# Altium project bms_mainboard-1_1.PrjPcb (part 1 of 8)
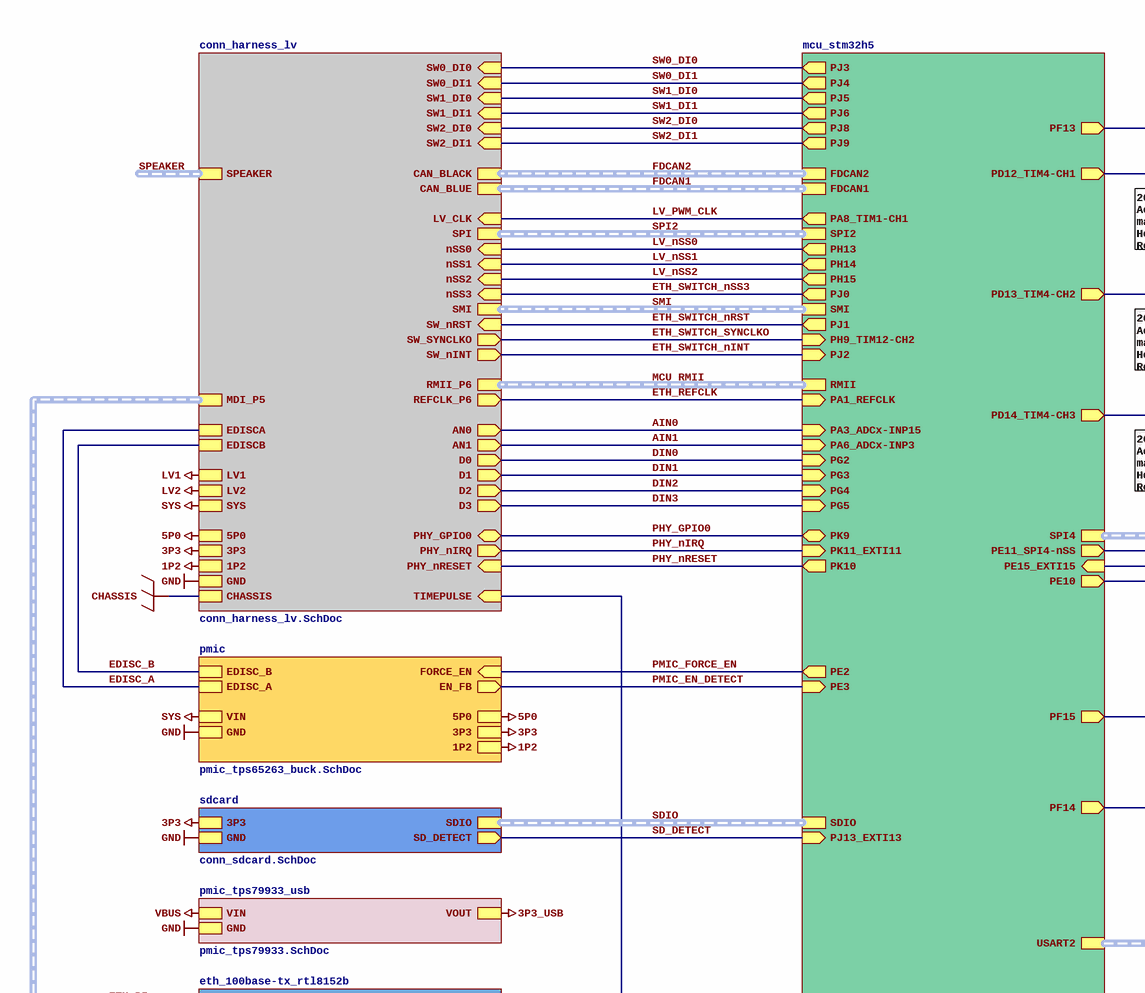
[diagram p0: top.SchDoc, top left]
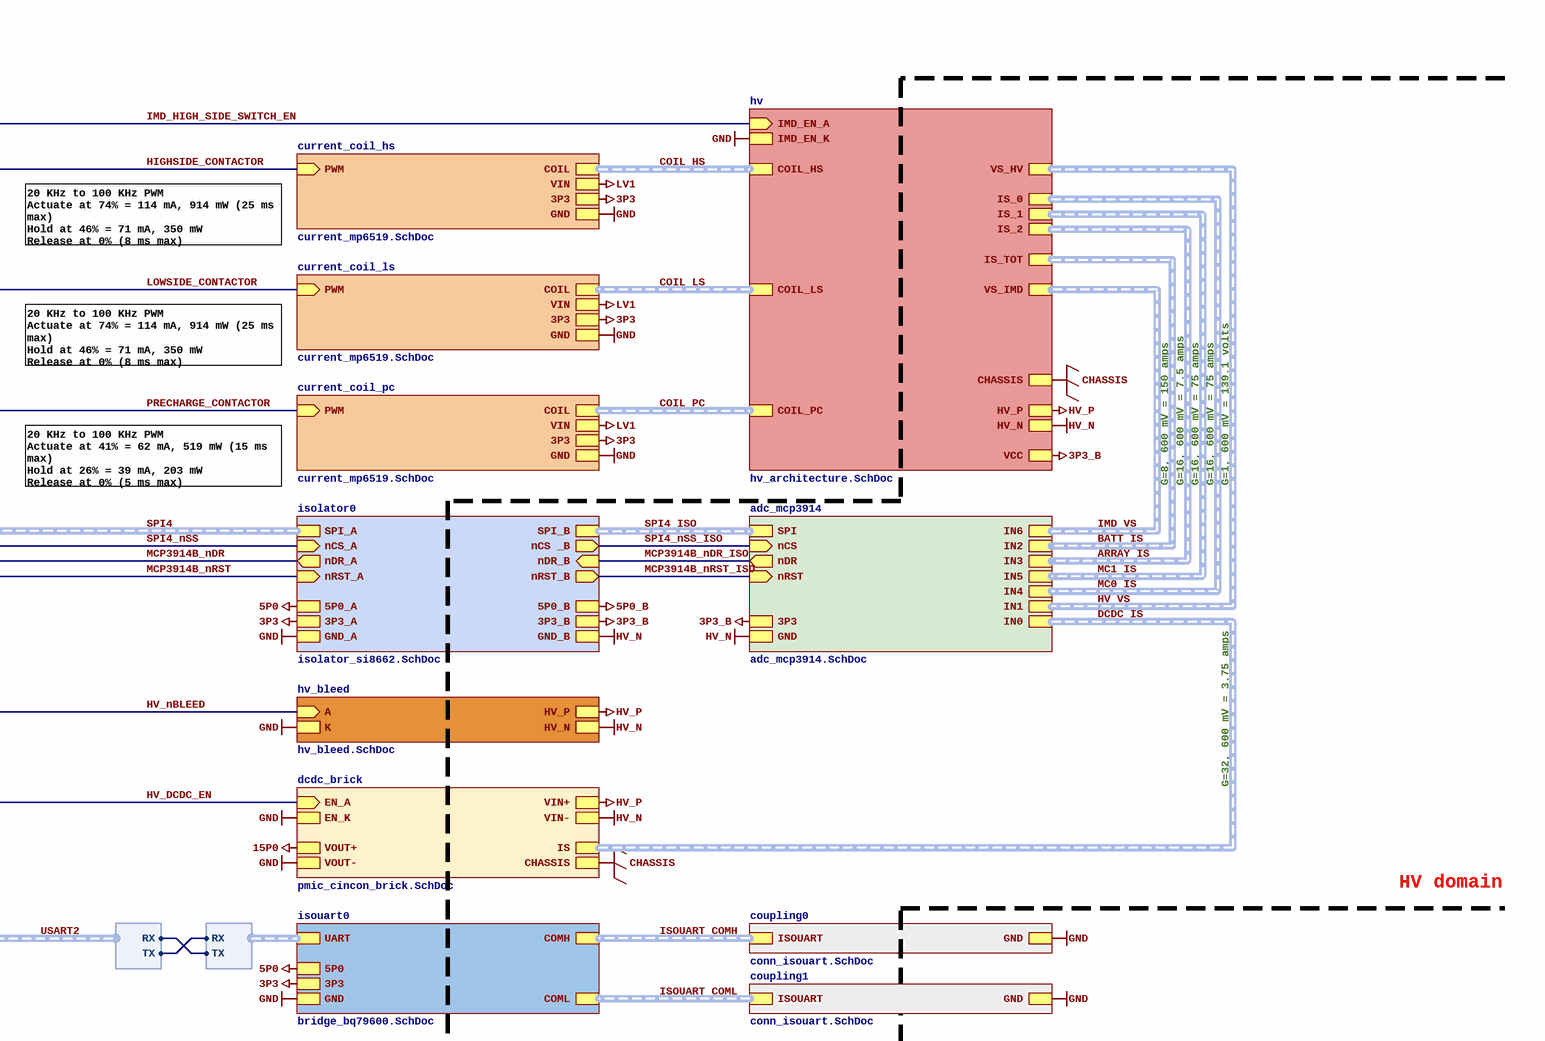
[diagram p1: top.SchDoc, top right]
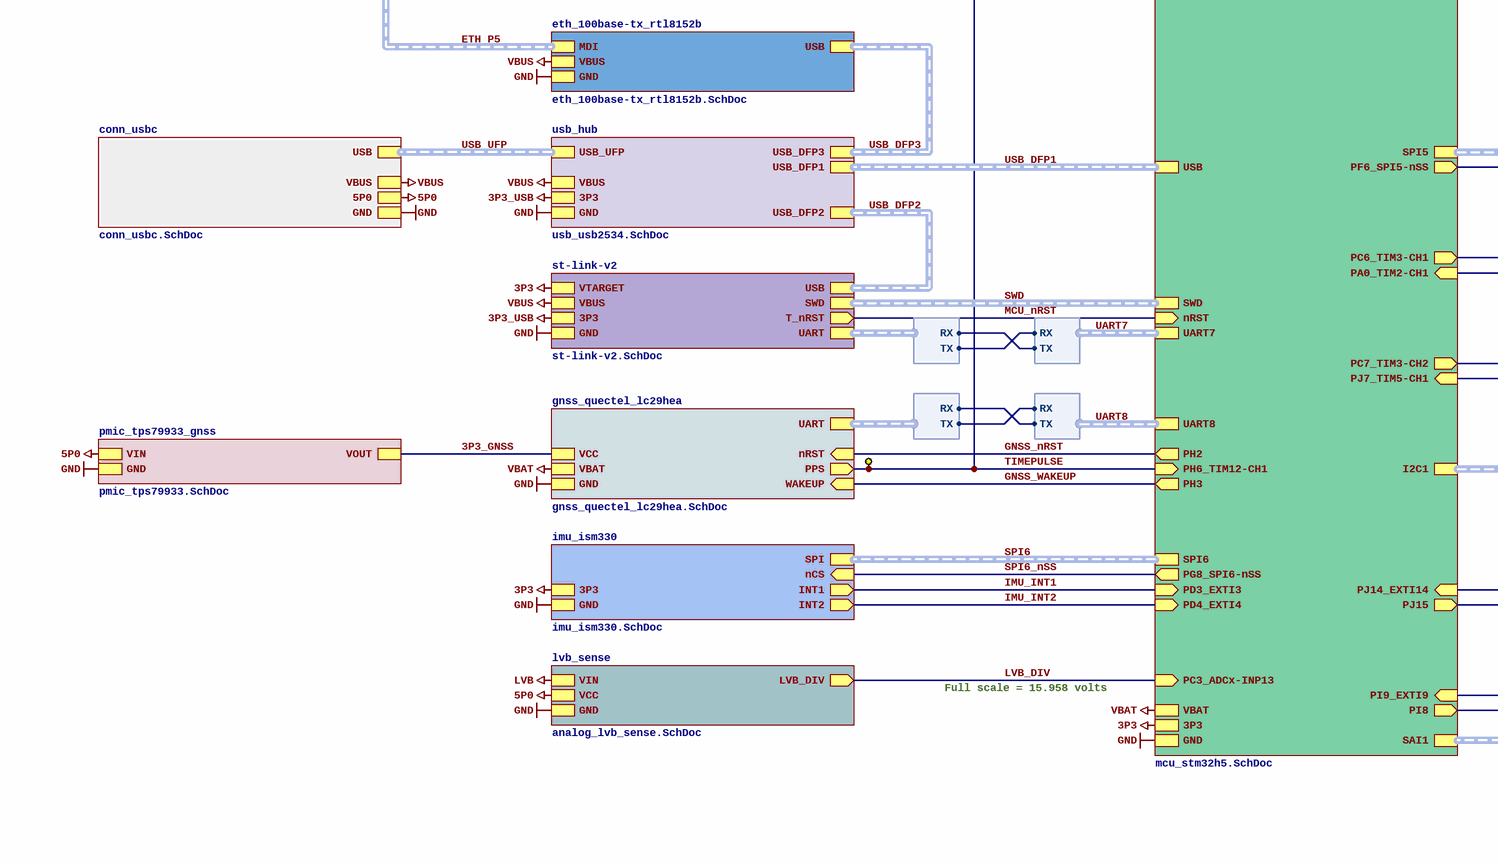
[diagram p2: top.SchDoc, bottom left]
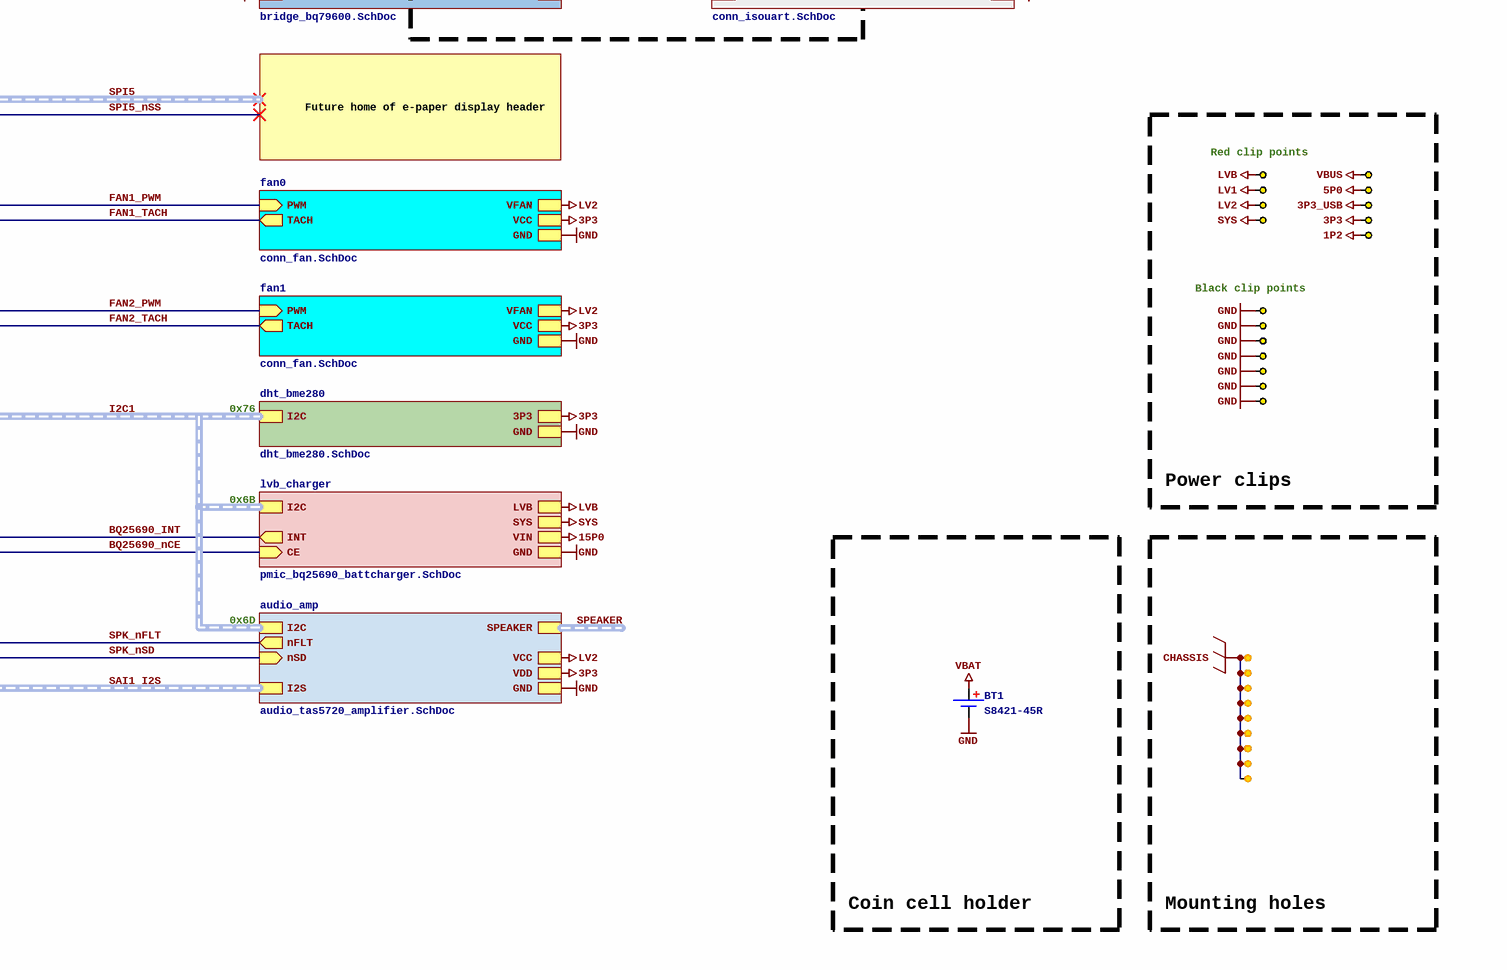
[diagram p3: top.SchDoc, bottom right]
35 sheets, 964 parts. Net scope: strictly hierarchical (ports join the sheet entries above them; power ports are local).
Board file: bms_mainboard-1_1.PcbDoc
Sheets:
  top.SchDoc
    coupling0 = conn_isouart.SchDoc
    isouart0 = bridge_bq79600.SchDoc
    mcu_stm32h5 = mcu_stm32h5.SchDoc
      ref_mcp1502_2p5 = ref_mcp1502_2p5.SchDoc
    pmic = pmic_tps65263_buck.SchDoc
    sdcard = conn_sdcard.SchDoc
    adc_mcp3914 = adc_mcp3914.SchDoc
      shunt0 = filter_diff_shunt.SchDoc
      shunt2 = filter_diff_shunt.SchDoc
      shunt3 = filter_diff_shunt.SchDoc
      shunt4 = filter_diff_shunt.SchDoc
      shunt5 = filter_diff_shunt.SchDoc
    hv = hv_architecture.SchDoc
      hv_buffer0 = analog_tlv379_buffer.SchDoc
      hv_buffer1 = analog_tlv379_buffer.SchDoc
    fan0 = conn_fan.SchDoc
    hv_bleed = hv_bleed.SchDoc
    current_coil_hs = current_mp6519.SchDoc
    current_coil_ls = current_mp6519.SchDoc
    current_coil_pc = current_mp6519.SchDoc
    dcdc_brick = pmic_cincon_brick.SchDoc
    usb_hub = usb_usb2534.SchDoc
    conn_usbc = conn_usbc.SchDoc
    st-link-v2 = st-link-v2.SchDoc
    conn_harness_lv = conn_harness_lv.SchDoc
      can1 = can_tcan1462v.SchDoc
      can0 = can_tcan1462v.SchDoc
      ethernet_switch = eth_ksz8567r_switch.SchDoc
        mag0 = eth_100base-tx_magnetics.SchDoc
        mag1 = eth_100base-tx_magnetics.SchDoc
        mag2 = eth_100base-tx_magnetics.SchDoc
      lv_switch0 = switch_vn9e30f.SchDoc
      lv_switch1 = switch_vn9e30f.SchDoc
      lv_switch2 = switch_vn9e30f.SchDoc
      sensor0 = analog_sensor_input.SchDoc
      sensor1 = analog_sensor_input.SchDoc
      digital0 = digital_input_protection.SchDoc
      digital1 = digital_input_protection.SchDoc
      digital2 = digital_input_protection.SchDoc
      digital3 = digital_input_protection.SchDoc
      eth_10base-t1s_phy = eth_10base-t1s_phy.SchDoc
    isolator0 = isolator_si8662.SchDoc
    pmic_tps79933_usb = pmic_tps79933.SchDoc
    imu_ism330 = imu_ism330.SchDoc
    dht_bme280 = dht_bme280.SchDoc
    gnss_quectel_lc29hea = gnss_quectel_lc29hea.SchDoc
    pmic_tps79933_gnss = pmic_tps79933.SchDoc
    lvb_sense = analog_lvb_sense.SchDoc
    coupling1 = conn_isouart.SchDoc
    fan1 = conn_fan.SchDoc
    lvb_charger = pmic_bq25690_battcharger.SchDoc
    audio_amp = audio_tas5720_amplifier.SchDoc
    eth_100base-tx_rtl8152b = eth_100base-tx_rtl8152b.SchDoc

## Sheet top.SchDoc
size C; SheetNumber: 1

### Parts
BT1  S8421-45R  [HOLDER_BATT_CR2032_HARWIN_S8421-45R]
MH1  HOLE  [HOLE_M3]  (value not drawn)  (no BOM)
MH2  HOLE  [HOLE_M3]  (value not drawn)  (no BOM)
MH3  HOLE  [HOLE_M3]  (value not drawn)  (no BOM)
MH4  HOLE  [HOLE_M3]  (value not drawn)  (no BOM)
MH5  HOLE  [HOLE_M3]  (value not drawn)  (no BOM)
MH6  HOLE  [HOLE_M3]  (value not drawn)  (no BOM)
MH7  HOLE  [HOLE_M3]  (value not drawn)  (no BOM)
MH8  HOLE  [HOLE_M3]  (value not drawn)  (no BOM)
MH9  HOLE  [HOLE_M3]  (value not drawn)  (no BOM)
TP4  RH-5002  [TP_RH-5002]  (value not drawn)
TP5  RH-5000  [TP_RH-5000]  (value not drawn)
TP32  RH-5000  [TP_RH-5000]  (value not drawn)
TP33  RH-5000  [TP_RH-5000]  (value not drawn)
TP34  RH-5000  [TP_RH-5000]  (value not drawn)
TP35  RH-5000  [TP_RH-5000]  (value not drawn)
TP36  RH-5000  [TP_RH-5000]  (value not drawn)
TP37  RH-5000  [TP_RH-5000]  (value not drawn)
TP39  RH-5001  [TP_RH-5001]  (value not drawn)
TP41  RH-5001  [TP_RH-5001]  (value not drawn)
TP43  RH-5001  [TP_RH-5001]  (value not drawn)
TP45  RH-5001  [TP_RH-5001]  (value not drawn)
TP46  RH-5001  [TP_RH-5001]  (value not drawn)
TP47  RH-5001  [TP_RH-5001]  (value not drawn)
TP48  RH-5001  [TP_RH-5001]  (value not drawn)
TP89  RH-5000  [TP_RH-5000]  (value not drawn)
TP90  RH-5000  [TP_RH-5000]  (value not drawn)

### Blocks framed on the sheet
Power clips: TP5 TP32-TP37 TP39 TP41 TP43 TP45-TP48 TP89 TP90
Coin cell holder: BT1
Mounting holes: MH1-MH9

### Sub-sheets
adc_mcp3914 = adc_mcp3914.SchDoc: IN0 (harness DIFF), IN1 (harness DIFF), IN2 (harness DIFF), IN3 (harness DIFF), IN4 (harness DIFF), IN5 (harness DIFF), SPI (harness SPI), 3P3, GND, nCS (in), nDR (out), nRST (in), IN6 (harness DIFF)
audio_amp = audio_tas5720_amplifier.SchDoc: GND, VCC, VDD, SPEAKER (harness DIFF), I2C (harness I2C), nFLT (out), nSD (in), I2S (harness I2S)
conn_harness_lv = conn_harness_lv.SchDoc: GND, 3P3, 5P0, SPI (harness SPI), AN0 (out), AN1 (out), nSS2 (in), nSS1 (in), nSS0 (in), SW_nRST (in), REFCLK_P6 (out), LV_CLK (in), EDISCA, EDISCB, D0 (out), D1 (out), D2 (out), D3 (out), CAN_BLUE (harness CAN), CAN_BLACK (harness CAN), SMI (harness SMI), RMII_P6 (harness RMII), LV2, LV1, 1P2, TIMEPULSE (in), SYS, CHASSIS, nSS3 (in), PHY_GPIO0 (bidir), PHY_nIRQ (out), PHY_nRESET (in), SW_SYNCLKO (out), SW_nINT (out), SPEAKER (harness DIFF), MDI_P5 (harness 100BASE-TX), SW0_DI0 (in), SW0_DI1 (in), SW2_DI0 (in), SW2_DI1 (in), SW1_DI0 (in), SW1_DI1 (in)
conn_usbc = conn_usbc.SchDoc: 5P0, USB (harness DIFF), GND, VBUS
coupling0 = conn_isouart.SchDoc: ISOUART (harness DIFF), GND
coupling1 = conn_isouart.SchDoc: ISOUART (harness DIFF), GND
current_coil_hs = current_mp6519.SchDoc: COIL (harness DIFF), VIN, PWM (in), GND, 3P3
current_coil_ls = current_mp6519.SchDoc: COIL (harness DIFF), VIN, PWM (in), GND, 3P3
current_coil_pc = current_mp6519.SchDoc: COIL (harness DIFF), VIN, PWM (in), GND, 3P3
dcdc_brick = pmic_cincon_brick.SchDoc: EN_A (in), EN_K, VIN+, VIN-, VOUT+, VOUT-, IS (harness DIFF), CHASSIS
dht_bme280 = dht_bme280.SchDoc: I2C (harness I2C), GND, 3P3
eth_100base-tx_rtl8152b = eth_100base-tx_rtl8152b.SchDoc: VBUS, GND, USB (harness DIFF), MDI (harness 100BASE-TX)
fan0 = conn_fan.SchDoc: GND, VFAN, PWM (in), VCC, TACH (out)
fan1 = conn_fan.SchDoc: GND, VFAN, PWM (in), VCC, TACH (out)
gnss_quectel_lc29hea = gnss_quectel_lc29hea.SchDoc: GND, VCC, VBAT, PPS (out), nRST (in), UART (harness UART), WAKEUP (in)
hv = hv_architecture.SchDoc: IS_0 (harness DIFF), IS_1 (harness DIFF), IS_2 (harness DIFF), IS_TOT (harness DIFF), COIL_HS (harness DIFF), COIL_LS (harness DIFF), COIL_PC (harness DIFF), HV_P, HV_N, VS_HV (harness DIFF), CHASSIS, VS_IMD (harness DIFF), IMD_EN_A (in), IMD_EN_K, VCC
hv_bleed = hv_bleed.SchDoc: A (in), K, HV_N, HV_P
imu_ism330 = imu_ism330.SchDoc: 3P3, GND, INT1 (out), INT2 (out), SPI (harness SPI), nCS (in)
isolator0 = isolator_si8662.SchDoc: SPI_A (harness SPI), nCS_A (in), nRST_A (in), nDR_A (out), SPI_B (harness SPI), nCS _B (out), nRST_B (out), nDR_B (in), 3P3_A, GND_A, 5P0_A, 3P3_B, GND_B, 5P0_B
isouart0 = bridge_bq79600.SchDoc: COMH (harness DIFF), GND, 3P3, UART (harness UART), 5P0, COML (harness DIFF)
lvb_charger = pmic_bq25690_battcharger.SchDoc: I2C (harness I2C), LVB, SYS, VIN, GND, INT (out), CE (in)
lvb_sense = analog_lvb_sense.SchDoc: LVB_DIV (out), VIN, VCC, GND
mcu_stm32h5 = mcu_stm32h5.SchDoc: GND, 3P3, SDIO (harness SDIO), VBAT, SPI4 (harness SPI), PA1_REFCLK (in), RMII (harness RMII), SMI (harness SMI), PD12_TIM4-CH1 (out), PD13_TIM4-CH2 (out), USB (harness DIFF), SWD (harness SWD), UART7 (harness UART), nRST (in), SPI2 (harness SPI), PD14_TIM4-CH3 (out), PA3_ADCx-INP15 (in), PA6_ADCx-INP3 (in), PE11_SPI4-nSS (out), PA0_TIM2-CH1 (in), PJ7_TIM5-CH1 (in), PC6_TIM3-CH1 (out), PC7_TIM3-CH2 (out), PJ13_EXTI13 (in), PE10 (out), UART8 (harness UART), I2C1 (harness I2C), PH6_TIM12-CH1 (in), PH13 (out), PH14 (out), PJ0 (out), PH2 (out), PE15_EXTI15 (in), SPI5 (harness SPI), PF6_SPI5-nSS (out), PF15 (out), PF14 (out), PG2 (in), PG3 (in), PG5 (in), PG4 (in), PK11_EXTI11 (in), PK10 (out), PK9 (bidir), PE2 (out), PE3 (in), SPI6 (harness SPI), PG8_SPI6-nSS (out), PD3_EXTI3 (in), PD4_EXTI4 (in), PH9_TIM12-CH2 (in), PJ2 (in), PJ1 (out), USART2 (harness UART), PH3 (out), PA8_TIM1-CH1 (out), FDCAN2 (harness CAN), FDCAN1 (harness CAN), PH15 (out), PC3_ADCx-INP13 (in), PF13 (out), PJ15 (out), PJ14_EXTI14 (in), PI9_EXTI9 (in), PI8 (out), SAI1 (harness I2S), PJ3 (out), PJ4 (out), PJ5 (out), PJ6 (out), PJ8 (out), PJ9 (out)
pmic = pmic_tps65263_buck.SchDoc: VIN, 5P0, GND, 3P3, 1P2, EDISC_A, EDISC_B, FORCE_EN (in), EN_FB (out)
pmic_tps79933_gnss = pmic_tps79933.SchDoc: GND, VIN, VOUT
pmic_tps79933_usb = pmic_tps79933.SchDoc: GND, VIN, VOUT
sdcard = conn_sdcard.SchDoc: 3P3, GND, SD_DETECT (out), SDIO (harness SDIO)
st-link-v2 = st-link-v2.SchDoc: USB (harness DIFF), GND, 3P3, VBUS, SWD (harness SWD), T_nRST (out), UART (harness UART), VTARGET
usb_hub = usb_usb2534.SchDoc: 3P3, GND, USB_DFP2 (harness DIFF), USB_DFP1 (harness DIFF), USB_UFP (harness DIFF), VBUS, USB_DFP3 (harness DIFF)

### Harnesses
UART: RX, TX

### Nets
1P2: TP37.1 ; sheet pmic/1P2, sheet conn_harness_lv/1P2
3P3: TP35.1 ; sheet isouart0/3P3, sheet mcu_stm32h5/3P3, sheet pmic/3P3, sheet sdcard/3P3, sheet fan0/VCC, sheet current_coil_hs/3P3, sheet current_coil_ls/3P3, sheet current_coil_pc/3P3, sheet st-link-v2/VTARGET, sheet conn_harness_lv/3P3, sheet isolator0/3P3_A, sheet imu_ism330/3P3, sheet dht_bme280/3P3, sheet fan1/VCC, sheet audio_amp/VDD
3P3_B: sheet adc_mcp3914/3P3, sheet hv/VCC, sheet isolator0/3P3_B
3P3_USB: TP90.1 ; sheet usb_hub/3P3, sheet st-link-v2/3P3, sheet pmic_tps79933_usb/VOUT
5P0: TP33.1 ; sheet isouart0/5P0, sheet pmic/5P0, sheet conn_usbc/5P0, sheet conn_harness_lv/5P0, sheet isolator0/5P0_A, sheet pmic_tps79933_gnss/VIN, sheet lvb_sense/VCC
15P0: sheet dcdc_brick/VOUT+, sheet lvb_charger/VIN
CHASSIS: MH1.1 MH2.1 MH3.1 MH4.1 MH5.1 MH6.1 MH7.1 MH8.1 MH9.1 ; sheet hv/CHASSIS, sheet dcdc_brick/CHASSIS, sheet conn_harness_lv/CHASSIS
GND: BT1.2(-) TP39.1 TP41.1 TP43.1 TP45.1 TP46.1 TP47.1 TP48.1 ; sheet coupling0/GND, sheet isouart0/GND, sheet mcu_stm32h5/GND, sheet pmic/GND, sheet sdcard/GND, sheet hv/IMD_EN_K, sheet fan0/GND, sheet hv_bleed/K, sheet current_coil_hs/GND, sheet current_coil_ls/GND, sheet current_coil_pc/GND, sheet dcdc_brick/EN_K, sheet dcdc_brick/VOUT-, sheet usb_hub/GND, sheet conn_usbc/GND, sheet st-link-v2/GND, sheet conn_harness_lv/GND, sheet isolator0/GND_A, sheet pmic_tps79933_usb/GND, sheet imu_ism330/GND, sheet dht_bme280/GND, sheet gnss_quectel_lc29hea/GND, sheet pmic_tps79933_gnss/GND, sheet lvb_sense/GND, sheet coupling1/GND, sheet fan1/GND, sheet lvb_charger/GND, sheet audio_amp/GND, sheet eth_100base-tx_rtl8152b/GND
HV_N: sheet adc_mcp3914/GND, sheet hv/HV_N, sheet hv_bleed/HV_N, sheet dcdc_brick/VIN-, sheet isolator0/GND_B
HV_P: sheet hv/HV_P, sheet hv_bleed/HV_P, sheet dcdc_brick/VIN+
LV1: TP34.1 ; sheet current_coil_hs/VIN, sheet current_coil_ls/VIN, sheet current_coil_pc/VIN, sheet conn_harness_lv/LV1
LV2: TP36.1 ; sheet fan0/VFAN, sheet conn_harness_lv/LV2, sheet fan1/VFAN, sheet audio_amp/VCC
LVB: TP32.1 ; sheet lvb_sense/VIN, sheet lvb_charger/LVB
SYS: TP5.1 ; sheet pmic/VIN, sheet conn_harness_lv/SYS, sheet lvb_charger/SYS
VBAT: BT1.1(+) ; sheet mcu_stm32h5/VBAT, sheet gnss_quectel_lc29hea/VBAT
VBUS: TP89.1 ; sheet usb_hub/VBUS, sheet conn_usbc/VBUS, sheet st-link-v2/VBUS, sheet pmic_tps79933_usb/VIN, sheet eth_100base-tx_rtl8152b/VBUS
3P3_GNSS: sheet gnss_quectel_lc29hea/VCC, sheet pmic_tps79933_gnss/VOUT
AIN0: sheet mcu_stm32h5/PA3_ADCx-INP15, sheet conn_harness_lv/AN0
AIN1: sheet mcu_stm32h5/PA6_ADCx-INP3, sheet conn_harness_lv/AN1
BQ25690_INT: sheet mcu_stm32h5/PJ14_EXTI14, sheet lvb_charger/INT
BQ25690_nCE: sheet mcu_stm32h5/PJ15, sheet lvb_charger/CE
DIN0: sheet mcu_stm32h5/PG2, sheet conn_harness_lv/D0
DIN1: sheet mcu_stm32h5/PG3, sheet conn_harness_lv/D1
DIN2: sheet mcu_stm32h5/PG4, sheet conn_harness_lv/D2
DIN3: sheet mcu_stm32h5/PG5, sheet conn_harness_lv/D3
EDISC_A: sheet pmic/EDISC_A, sheet conn_harness_lv/EDISCA
EDISC_B: sheet pmic/EDISC_B, sheet conn_harness_lv/EDISCB
ETH_REFCLK: sheet mcu_stm32h5/PA1_REFCLK, sheet conn_harness_lv/REFCLK_P6
ETH_SWITCH_nINT: sheet mcu_stm32h5/PJ2, sheet conn_harness_lv/SW_nINT
ETH_SWITCH_nRST: sheet mcu_stm32h5/PJ1, sheet conn_harness_lv/SW_nRST
ETH_SWITCH_nSS3: sheet mcu_stm32h5/PJ0, sheet conn_harness_lv/nSS3
ETH_SWITCH_SYNCLKO: sheet mcu_stm32h5/PH9_TIM12-CH2, sheet conn_harness_lv/SW_SYNCLKO
FAN1_PWM: sheet mcu_stm32h5/PC6_TIM3-CH1, sheet fan0/PWM
FAN1_TACH: sheet mcu_stm32h5/PA0_TIM2-CH1, sheet fan0/TACH
FAN2_PWM: sheet mcu_stm32h5/PC7_TIM3-CH2, sheet fan1/PWM
FAN2_TACH: sheet mcu_stm32h5/PJ7_TIM5-CH1, sheet fan1/TACH
GNSS_nRST: sheet mcu_stm32h5/PH2, sheet gnss_quectel_lc29hea/nRST
GNSS_WAKEUP: sheet mcu_stm32h5/PH3, sheet gnss_quectel_lc29hea/WAKEUP
HIGHSIDE_CONTACTOR: sheet mcu_stm32h5/PD12_TIM4-CH1, sheet current_coil_hs/PWM
HV_DCDC_EN: sheet mcu_stm32h5/PF14, sheet dcdc_brick/EN_A
HV_nBLEED: sheet mcu_stm32h5/PF15, sheet hv_bleed/A
IMD_HIGH_SIDE_SWITCH_EN: sheet mcu_stm32h5/PF13, sheet hv/IMD_EN_A
IMU_INT1: sheet mcu_stm32h5/PD3_EXTI3, sheet imu_ism330/INT1
IMU_INT2: sheet mcu_stm32h5/PD4_EXTI4, sheet imu_ism330/INT2
LOWSIDE_CONTACTOR: sheet mcu_stm32h5/PD13_TIM4-CH2, sheet current_coil_ls/PWM
LV_nSS0: sheet mcu_stm32h5/PH13, sheet conn_harness_lv/nSS0
LV_nSS1: sheet mcu_stm32h5/PH14, sheet conn_harness_lv/nSS1
LV_nSS2: sheet mcu_stm32h5/PH15, sheet conn_harness_lv/nSS2
LV_PWM_CLK: sheet mcu_stm32h5/PA8_TIM1-CH1, sheet conn_harness_lv/LV_CLK
LVB_DIV: sheet mcu_stm32h5/PC3_ADCx-INP13, sheet lvb_sense/LVB_DIV
MCP3914B_nDR: sheet mcu_stm32h5/PE15_EXTI15, sheet isolator0/nDR_A
MCP3914B_nDR_ISO: sheet adc_mcp3914/nDR, sheet isolator0/nDR_B
MCP3914B_nRST: sheet mcu_stm32h5/PE10, sheet isolator0/nRST_A
MCP3914B_nRST_ISO: sheet adc_mcp3914/nRST, sheet isolator0/nRST_B
MCU_nRST: sheet mcu_stm32h5/nRST, sheet st-link-v2/T_nRST
PHY_GPIO0: sheet mcu_stm32h5/PK9, sheet conn_harness_lv/PHY_GPIO0
PHY_nIRQ: sheet mcu_stm32h5/PK11_EXTI11, sheet conn_harness_lv/PHY_nIRQ
PHY_nRESET: sheet mcu_stm32h5/PK10, sheet conn_harness_lv/PHY_nRESET
PMIC_EN_DETECT: sheet mcu_stm32h5/PE3, sheet pmic/EN_FB
PMIC_FORCE_EN: sheet mcu_stm32h5/PE2, sheet pmic/FORCE_EN
PRECHARGE_CONTACTOR: sheet mcu_stm32h5/PD14_TIM4-CH3, sheet current_coil_pc/PWM
SD_DETECT: sheet mcu_stm32h5/PJ13_EXTI13, sheet sdcard/SD_DETECT
SPI4_nSS: sheet mcu_stm32h5/PE11_SPI4-nSS, sheet isolator0/nCS_A
SPI4_nSS_ISO: sheet adc_mcp3914/nCS, sheet isolator0/nCS _B
SPI6_nSS: sheet mcu_stm32h5/PG8_SPI6-nSS, sheet imu_ism330/nCS
SPK_nFLT: sheet mcu_stm32h5/PI9_EXTI9, sheet audio_amp/nFLT
SPK_nSD: sheet mcu_stm32h5/PI8, sheet audio_amp/nSD
SW0_DI0: sheet mcu_stm32h5/PJ3, sheet conn_harness_lv/SW0_DI0
SW0_DI1: sheet mcu_stm32h5/PJ4, sheet conn_harness_lv/SW0_DI1
SW1_DI0: sheet mcu_stm32h5/PJ5, sheet conn_harness_lv/SW1_DI0
SW1_DI1: sheet mcu_stm32h5/PJ6, sheet conn_harness_lv/SW1_DI1
SW2_DI0: sheet mcu_stm32h5/PJ8, sheet conn_harness_lv/SW2_DI0
SW2_DI1: sheet mcu_stm32h5/PJ9, sheet conn_harness_lv/SW2_DI1
TIMEPULSE: TP4.1 ; sheet mcu_stm32h5/PH6_TIM12-CH1, sheet conn_harness_lv/TIMEPULSE, sheet gnss_quectel_lc29hea/PPS
UART7.RX: sheet st-link-v2/UART.TX, sheet mcu_stm32h5/UART7.RX
UART7.TX: sheet st-link-v2/UART.RX, sheet mcu_stm32h5/UART7.TX
UART8.RX: sheet gnss_quectel_lc29hea/UART.TX, sheet mcu_stm32h5/UART8.RX
UART8.TX: sheet gnss_quectel_lc29hea/UART.RX, sheet mcu_stm32h5/UART8.TX
USART2.RX: sheet mcu_stm32h5/USART2.RX, sheet isouart0/UART.TX
USART2.TX: sheet mcu_stm32h5/USART2.TX, sheet isouart0/UART.RX

### Buses and harness runs
harness ARRAY_IS = sheet adc_mcp3914/IN3 = sheet hv/IS_2
harness BATT_IS = sheet adc_mcp3914/IN2 = sheet hv/IS_TOT
harness COIL_HS = sheet current_coil_hs/COIL = sheet hv/COIL_HS
harness COIL_LS = sheet current_coil_ls/COIL = sheet hv/COIL_LS
harness COIL_PC = sheet current_coil_pc/COIL = sheet hv/COIL_PC
harness DCDC_IS = sheet adc_mcp3914/IN0 = sheet dcdc_brick/IS
harness ETH_P5 = sheet conn_harness_lv/MDI_P5 = sheet eth_100base-tx_rtl8152b/MDI
harness FDCAN1 = sheet conn_harness_lv/CAN_BLUE = sheet mcu_stm32h5/FDCAN1
harness FDCAN2 = sheet conn_harness_lv/CAN_BLACK = sheet mcu_stm32h5/FDCAN2
harness HV_VS = sheet adc_mcp3914/IN1 = sheet hv/VS_HV
harness I2C1 = sheet audio_amp/I2C = sheet dht_bme280/I2C = sheet lvb_charger/I2C = sheet mcu_stm32h5/I2C1
harness IMD_VS = sheet adc_mcp3914/IN6 = sheet hv/VS_IMD
harness ISOUART_COMH = sheet coupling0/ISOUART = sheet isouart0/COMH
harness ISOUART_COML = sheet coupling1/ISOUART = sheet isouart0/COML
harness MC0_IS = sheet adc_mcp3914/IN4 = sheet hv/IS_0
harness MC1_IS = sheet adc_mcp3914/IN5 = sheet hv/IS_1
harness MCU_RMII = sheet conn_harness_lv/RMII_P6 = sheet mcu_stm32h5/RMII
harness SAI1_I2S = sheet audio_amp/I2S = sheet mcu_stm32h5/SAI1
harness SDIO = sheet mcu_stm32h5/SDIO = sheet sdcard/SDIO
harness SMI = sheet conn_harness_lv/SMI = sheet mcu_stm32h5/SMI
harness SPEAKER = sheet audio_amp/SPEAKER
harness SPEAKER = sheet conn_harness_lv/SPEAKER
harness SPI2 = sheet conn_harness_lv/SPI = sheet mcu_stm32h5/SPI2
harness SPI4 = sheet isolator0/SPI_A = sheet mcu_stm32h5/SPI4
harness SPI4_ISO = sheet adc_mcp3914/SPI = sheet isolator0/SPI_B
harness SPI5 = sheet mcu_stm32h5/SPI5
harness SPI6 = sheet imu_ism330/SPI = sheet mcu_stm32h5/SPI6
harness SWD = sheet mcu_stm32h5/SWD = sheet st-link-v2/SWD
harness UART7 = sheet mcu_stm32h5/UART7
harness UART8 = sheet mcu_stm32h5/UART8
harness USART2 = sheet mcu_stm32h5/USART2
harness USB_DFP1 = sheet mcu_stm32h5/USB = sheet usb_hub/USB_DFP1
harness USB_DFP2 = sheet st-link-v2/USB = sheet usb_hub/USB_DFP2
harness USB_DFP3 = sheet eth_100base-tx_rtl8152b/USB = sheet usb_hub/USB_DFP3
harness USB_UFP = sheet conn_usbc/USB = sheet usb_hub/USB_UFP

### Notes on the sheet
- 20 KHz to 100 KHz PWM
  Actuate at 74% = 114 mA, 914 mW (25 ms max)
  Hold at 46% = 71 mA, 350 mW
  Release at 0% (8 ms max)
- 20 KHz to 100 KHz PWM
  Actuate at 41% = 62 mA, 519 mW (15 ms max)
  Hold at 26% = 39 mA, 203 mW
  Release at 0% (5 ms max)
- G=8, 600 mV = 150 amps
- G=16, 600 mV = 7.5 amps
- G=16, 600 mV = 75 amps
- G=1, 600 mV = 139.1 volts
- G=32, 600 mV = 3.75 amps
- HV domain
- Future home of e-paper display header
- (near TP32) Red clip points
- (near TP39) Black clip points
- 0x76
- 0x6B
- Full scale = 15.958 volts
- 0x6D

### Library data of the parts
BT1 = S8421-45R: EZ-Coin Cell Battery Retainer, Horizontal SMT, for CR2032 Coin Cell Batteries; Manufacturer: Harwin; ComponentLink1URL: https://cdn.harwin.com/pdfs/S8421R.pdf; ComponentLink1Description: Datasheet; Supplier 1: DigiKey; Supplier Part Number 1: 952-1737-1-ND; Manufacturer Part Number: S8421-45R; Supplier 2: LCSC; Supplier Part Number 2: C5185176; Supplier 3: Mouser; Supplier Part Number 3: 855-S8421-45R
MH1-MH9 = HOLE_M3: Manufacturer Part Number: HOLE_M3
TP4 = RH-5002: White through-hole PCB test point; Manufacturer: ronghe; ComponentLink1Description: Datasheet; ComponentLink1URL: https://datasheet.lcsc.com/lcsc/2307040929_ronghe-RH-5000_C5277086.pdf; Manufacturer Part Number: RH-5002; Supplier 2: LCSC; Supplier Part Number 2: C5199802
TP5 TP32-TP37 TP89 TP90 = RH-5000: Red through-hole PCB test point; Manufacturer: ronghe; ComponentLink1Description: Datasheet; ComponentLink1URL: https://datasheet.lcsc.com/lcsc/2307040929_ronghe-RH-5000_C5277086.pdf; Manufacturer Part Number: RH-5000; Supplier 2: LCSC; Supplier Part Number 2: C5277086
TP39 TP41 TP43 TP45-TP48 = RH-5001: Black through-hole PCB test point; Manufacturer: ronghe; ComponentLink1Description: Datasheet; ComponentLink1URL: https://datasheet.lcsc.com/lcsc/2307040929_ronghe-RH-5000_C5277086.pdf; Manufacturer Part Number: RH-5001; Supplier 2: LCSC; Supplier Part Number 2: C5199801

## Sheet conn_isouart.SchDoc
size A
Used 2 times, as channels coupling0, coupling1. Parts and nets are listed once, with the designators drawn on the sheet.
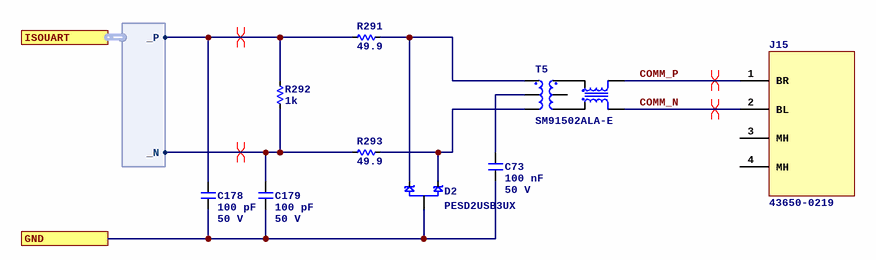
[diagram p4: conn_isouart.SchDoc]

### Parts
C73  Capacitance: 100 nF  Voltage Rating: 50 V  [C0402]  (hidden comment: CL05B104KB54PNC)
C178  Capacitance: 100 pF  Voltage Rating: 50 V  [C0402]  (hidden comment: CC0402KRX7R9BB101)
C179  Capacitance: 100 pF  Voltage Rating: 50 V  [C0402]  (hidden comment: CC0402KRX7R9BB101)
D2  PESD2USB3UX  [3SOT23]
J15  43650-0219  [MOLEX_MICROFIT_0436500219]
R291  value 49.9  [R0402]  (hidden comment: 0402WGF499JTCE)
R292  value 1k  [R0402]  (hidden comment: 0402WGF1001TCE)
R293  value 49.9  [R0402]  (hidden comment: 0402WGF499JTCE)
T5  SM91502ALA-E  [BOURNS_SM91502]

### Ports
GND, ISOUART (harness DIFF)

### Harnesses
DIFF: _P, _N

### Nets
COMM_N: J15.2(BL) T5.4
COMM_P: J15.1(BR) T5.6
GND: C73.2 C178.2 C179.2 D2.3 ; port GND
NetC73_1: C73.1 T5.2
NetC178_1: C178.1 R291.1 R292.2 ; port ISOUART._P
NetC179_1: C179.1 R292.1 R293.1 ; port ISOUART._N
NetD2_1: D2.1 R293.2 T5.3
NetD2_2: D2.2 R291.2 T5.1

Not connected (* = marked no-connect by the designer): J15 3(MH) 4(MH); T5 5

### Channels
coupling0: designators end in A; ports GND=GND
coupling1: designators end in B; ports GND=GND

### Layout directives
differential pair; differential pair class DE_100: COMM_N_coupling0, COMM_P_coupling0, ISOUART_COMH._N, ISOUART_COMH._P

### Library data of the parts
C73 = CL05B104KB54PNC: Manufacturer: Samsung Electro-Mechanics; Dielectric: X7R; ComponentLink1URL: https://wmsc.lcsc.com/wmsc/upload/file/pdf/v2/lcsc/2304140030_Samsung-Electro-Mechanics-CL05B104KB54PNC_C307331.pdf; ComponentLink1Description: Datasheet; Manufacturer Part Number: CL05B104KB54PNC; Package: 0402; Supplier 2: LCSC; Supplier Part Number 2: C307331
C178 C179 = CC0402KRX7R9BB101: Manufacturer: YAGEO; Dielectric: X7R; Manufacturer Part Number: CC0402KRX7R9BB101; ComponentLink1URL: https://wmsc.lcsc.com/wmsc/upload/file/pdf/v2/lcsc/2304140030_YAGEO-CC0402KRX7R9BB101_C281751.pdf; ComponentLink1Description: Datasheet; Package: 0402; Supplier 2: LCSC; Supplier Part Number 2: C281751
D2 = PESD2USB3UX: DIODE ESD USB SOT-23; Manufacturer: Nexperia USA Inc.; Polarity: Unidirectional; Capacitance (pF): 0.7; Standoff (V): 3.3; Min Breakdown Voltage: 4.2 V; Supplier 1: DigiKey; Supplier Part Number 1: 1727-PESD2USB3UX-CT-ND; Manufacturer Part Number: PESD2USB3UX; Supplier 2: LCSC; Supplier Part Number 2: C3708426; ComponentLink1Description: Datasheet; ComponentLink1URL: https://assets.nexperia.com/documents/data-sheet/PESD2USB3UX-T.pdf; Supplier 3: Mouser; Supplier Part Number 3: 771-PESD2USB3UX-TR
J15 = 43650-0219: Connector Header Through Hole 2 position 0.118" (3.00mm); Manufacturer: Molex; Manufacturer Part Number: 43650-0219; ComponentLink1Description: Drawing; ComponentLink1URL: https://www.molex.com/content/dam/molex/molex-dot-com/products/automated/en-us/salesdrawingpdf/436/43650/436500219_sd.pdf; ComponentLink2Description: Product page; ComponentLink2URL: https://www.molex.com/en-us/products/part-detail/436500219; Supplier 1: DigiKey; Supplier Part Number 1: WM14583-ND; Supplier Part Number 2: C19170957; Supplier 2: LCSC; Supplier 3: Mouser; Supplier Part Number 3: 538-43650-0219
R291 R293 = 0402WGF499JTCE: Manufacturer: UNI-ROYAL(Uniroyal Elec); Tolerance: 1%; Temperature Coefficient: ±100ppm/?; Power Rating (mW): 62.5; Manufacturer Part Number: 0402WGF499JTCE; ComponentLink1Description: Datasheet; ComponentLink1URL: https://wmsc.lcsc.com/wmsc/upload/file/pdf/v2/lcsc/2205311900_UNI-ROYAL-Uniroyal-Elec-0402WGF499JTCE_C25120.pdf; Package: 0402; Supplier 2: LCSC; Supplier Part Number 2: C25120
R292 = 0402WGF1001TCE: Manufacturer: UNI-ROYAL(Uniroyal Elec); Tolerance: 1%; Temperature Coefficient: ±100ppm/?; Power Rating (mW): 62.5; Manufacturer Part Number: 0402WGF1001TCE; ComponentLink1Description: Datasheet; ComponentLink1URL: https://wmsc.lcsc.com/wmsc/upload/file/pdf/v2/lcsc/2206010216_UNI-ROYAL-Uniroyal-Elec-0402WGF1001TCE_C11702.pdf; Package: 0402; Supplier 2: LCSC; Supplier Part Number 2: C11702
T5 = SM91502ALA-E: 200µH LAN Pulse Transformer 1CT:1CT Surface Mount; Manufacturer: Bourns Inc.; Supplier 1: DigiKey; ComponentLink1URL: https://www.bourns.com/docs/product-datasheets/sm91502ala.pdf; ComponentLink1Description: Datasheet; Supplier Part Number 1: 118-SM91502ALA-ECT-ND; Manufacturer Part Number: SM91502ALA-E; Supplier 2: LCSC; Supplier Part Number 2: C5337144; Supplier 3: Mouser; Supplier Part Number 3: 652-SM91502ALA-E

## Sheet bridge_bq79600.SchDoc
size A
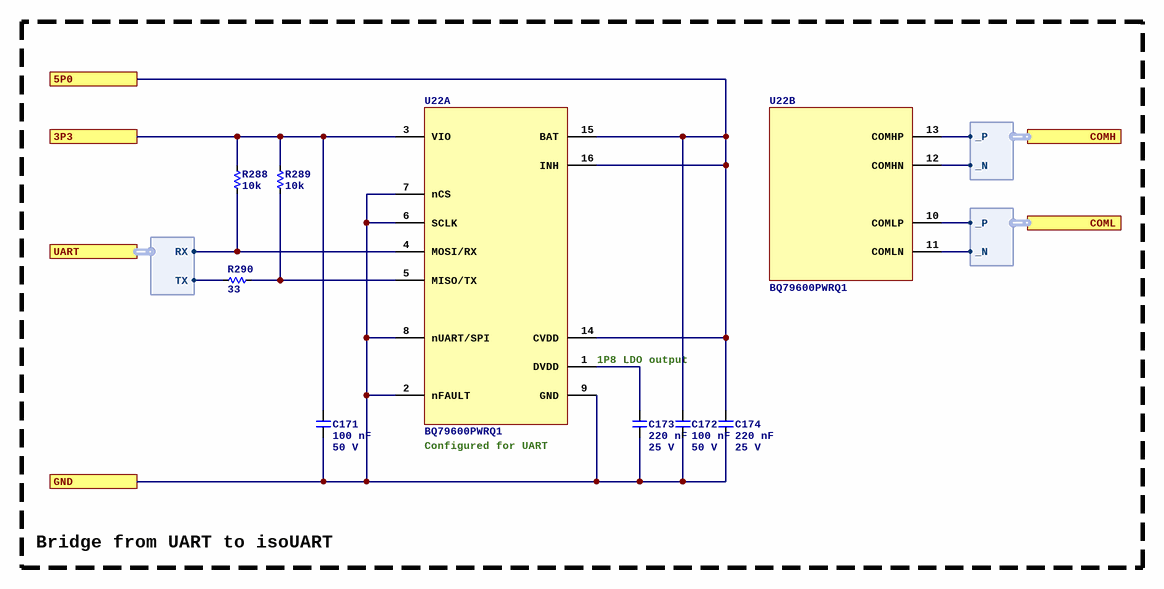
[diagram p5: bridge_bq79600.SchDoc]

### Parts
C171  Capacitance: 100 nF  Voltage Rating: 50 V  [C0402]  (hidden comment: CL05B104KB54PNC)
C172  Capacitance: 100 nF  Voltage Rating: 50 V  [C0402]  (hidden comment: CL05B104KB54PNC)
C173  Capacitance: 220 nF  Voltage Rating: 25 V  [C0402]  (hidden comment: TMK105B7224KV-FR)
C174  Capacitance: 220 nF  Voltage Rating: 25 V  [C0402]  (hidden comment: TMK105B7224KV-FR)
R288  value 10k  [R0402]  (hidden comment: 0402WGF1002TCE)
R289  value 10k  [R0402]  (hidden comment: 0402WGF1002TCE)
R290  value 33  [R0402]  (hidden comment: 0402WGF330JTCE)
U22  BQ79600PWRQ1  [TI_PW0016A]  (parts A,B of 2)

### Ports
3P3, 5P0, COMH (harness DIFF), COML (harness DIFF), GND, UART (harness UART)

### Harnesses
DIFF: _N, _P
UART: RX, TX

### Nets
3P3: C171.1 R288.2 R289.2 U22.3(VIO) ; port 3P3
5P0: C172.1 C174.1 U22.14(CVDD) U22.15(BAT) U22.16(INH) ; port 5P0
GND: C171.2 C172.2 C173.2 C174.2 U22.2(nFAULT) U22.6(SCLK) U22.7(nCS) U22.8(nUART/SPI) U22.9(GND) ; port GND
ISOUART_COMH._N: U22.12(COMHN) ; port COMH._N
ISOUART_COMH._P: U22.13(COMHP) ; port COMH._P
ISOUART_COML._N: U22.11(COMLN) ; port COML._N
ISOUART_COML._P: U22.10(COMLP) ; port COML._P
USART2.RX: R290.2 ; port UART.TX
USART2.TX: R288.1 U22.4(MOSI/RX) ; port UART.RX
NetC173_1: C173.1 U22.1(DVDD)
NetR289_1: R289.1 R290.1 U22.5(MISO/TX)

### Notes on the sheet
- (near U22) 1P8 LDO output
- (near U22) Configured for UART
- Bridge from UART to isoUART

### Library data of the parts
C171 C172 = CL05B104KB54PNC: as C73 on sheet conn_isouart; ComponentLink1URL: https://wmsc.lcsc.com/wmsc/upload/file/pdf/v2/lcsc/2304140030_Samsung-Electro-Mechanics-CL05B104KB54PNC_C307331.pdf; ComponentLink1Description: Datasheet; Manufacturer Part Number: CL05B104KB54PNC; Package: 0402; Supplier 2: LCSC; Supplier Part Number 2: C307331
C173 C174 = TMK105B7224KV-FR: Manufacturer: Taiyo Yuden; Dielectric: X7R; ComponentLink1URL: https://datasheet.lcsc.com/lcsc/2009251208_Taiyo-Yuden-TMK105B7224KV-FR_C841047.pdf; ComponentLink1Description: Datasheet; Manufacturer Part Number: TMK105B7224KV-FR; Package: 0402; Supplier 2: LCSC; Supplier Part Number 2: C841047
R288 R289 = 0402WGF1002TCE: Manufacturer: UNI-ROYAL(Uniroyal Elec); Tolerance: 1%; Temperature Coefficient: ±100ppm/?; Power Rating (mW): 62.5; ComponentLink1Description: Datasheet; ComponentLink1URL: https://wmsc.lcsc.com/wmsc/upload/file/pdf/v2/lcsc/2206010100_UNI-ROYAL-Uniroyal-Elec-0402WGF1002TCE_C25744.pdf; Manufacturer Part Number: 0402WGF1002TCE; Package: 0402; Supplier 2: LCSC; Supplier Part Number 2: C25744
R290 = 0402WGF330JTCE: Manufacturer: UNI-ROYAL(Uniroyal Elec); Tolerance: 1%; Temperature Coefficient: ±100ppm/?; Power Rating (mW): 62.5; ComponentLink1Description: Datasheet; ComponentLink1URL: https://wmsc.lcsc.com/wmsc/upload/file/pdf/v2/lcsc/2205311900_UNI-ROYAL-Uniroyal-Elec-0402WGF330JTCE_C25105.pdf; Manufacturer Part Number: 0402WGF330JTCE; Package: 0402; Supplier 2: LCSC; Supplier Part Number 2: C25105
U22 = BQ79600PWRQ1: Automotive SPI/UART communication interface functional-safety compliant with automatic host wakeup; Manufacturer: Texas Instruments; Manufacturer Part Number: BQ79600PWRQ1; Supplier 1: DigiKey; Supplier Part Number 1: 296-BQ79600PWRQ1CT-ND; ComponentLink1Description: Datasheet; ComponentLink1URL: https://www.ti.com/lit/ds/symlink/bq79600-q1.pdf; Supplier 2: LCSC; Supplier Part Number 2: C2869947; Supplier 3: Mouser; Supplier Part Number 3: 595-BQ79600PWRQ1